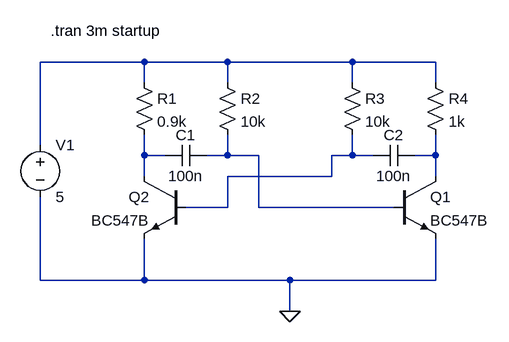
[diagram p0: schematic AstableVibrator.asc]
AstableVibrator.asc, the LTspice schematic file:
Version 4
SHEET 1 880 680
WIRE -288 -112 -448 -112
WIRE -160 -112 -288 -112
WIRE 32 -112 -160 -112
WIRE 160 -112 32 -112
WIRE -288 -80 -288 -112
WIRE -160 -80 -160 -112
WIRE 32 -80 32 -112
WIRE 160 -80 160 -112
WIRE -448 16 -448 -112
WIRE -288 32 -288 0
WIRE -256 32 -288 32
WIRE -160 32 -160 0
WIRE -160 32 -192 32
WIRE -112 32 -160 32
WIRE 32 32 32 0
WIRE 32 32 0 32
WIRE 64 32 32 32
WIRE 160 32 160 0
WIRE 160 32 128 32
WIRE -288 64 -288 32
WIRE 0 64 0 32
WIRE 0 64 -160 64
WIRE 160 64 160 32
WIRE -160 112 -160 64
WIRE -160 112 -224 112
WIRE -112 112 -112 32
WIRE 96 112 -112 112
WIRE -448 224 -448 96
WIRE -288 224 -288 160
WIRE -288 224 -448 224
WIRE -64 224 -288 224
WIRE 160 224 160 160
WIRE 160 224 -64 224
WIRE -64 272 -64 224
FLAG -64 272 0
SYMBOL npn 96 64 R0
SYMATTR InstName Q1
SYMATTR Value BC547B
SYMBOL npn -224 64 M0
SYMATTR InstName Q2
SYMATTR Value BC547B
SYMBOL res -304 -96 R0
SYMATTR InstName R1
SYMATTR Value 0.9k
SYMATTR SpiceLine tol=5
SYMBOL res -176 -96 R0
SYMATTR InstName R2
SYMATTR Value 10k
SYMBOL res 16 -96 R0
SYMATTR InstName R3
SYMATTR Value 10k
SYMBOL res 144 -96 R0
SYMATTR InstName R4
SYMATTR Value 1k
SYMATTR SpiceLine tol=5
SYMBOL cap -256 48 R270
WINDOW 0 32 32 VTop 2
WINDOW 3 0 32 VBottom 2
SYMATTR InstName C1
SYMATTR Value 100n
SYMBOL cap 64 48 R270
WINDOW 0 32 32 VTop 2
WINDOW 3 0 32 VBottom 2
SYMATTR InstName C2
SYMATTR Value 100n
SYMBOL voltage -448 0 R0
WINDOW 123 0 0 Left 0
WINDOW 39 0 0 Left 0
SYMATTR InstName V1
SYMATTR Value 5
TEXT -432 -160 Left 2 !.tran 3m startup

The netlist it stands for:
* AstableVibrator.asc
Q1 N005 N003 0 0 BC547B
Q2 N002 N004 0 0 BC547B
R1 N001 N002 0.9k tol=5
R2 N001 N003 10k
R3 N001 N004 10k
R4 N001 N005 1k tol=5
C1 N002 N003 100n
C2 N004 N005 100n
V1 N001 0 5
.model NPN NPN
.model PNP PNP
.lib standard.bjt
.tran 3m startup
.backanno
.end